# EAGLE design attiny24 (EAGLE 6.1)
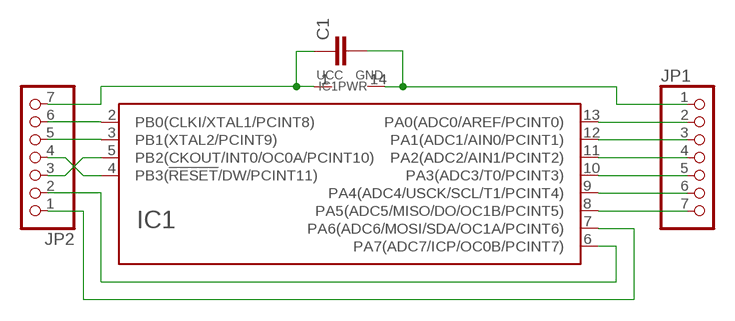
[diagram p0: schematic, sheet 1]

## Parts
C1  C-EUC0805K  [C0805K]
IC1  ATTINY24/44/84-SSU  [SOIC14]
JP1  PINHD-1X7  [1X07]
JP2  PINHD-1X7  [1X07]

## Nets
N$1: C1.1 IC1.1(UCC) JP2.7
N$2: C1.2 IC1.14(GND) JP1.1
N$3: IC1.4(PB3(!RESET!/DW/PCINT11)) JP2.4
N$4: IC1.2(PB0(CLKI/XTAL1/PCINT8)) JP2.6
N$5: IC1.3(PB1(XTAL2/PCINT9)) JP2.5
N$6: IC1.5(PB2(CKOUT/INT0/OC0A/PCINT10)) JP2.3
N$8: IC1.6(PA7(ADC7/ICP/OC0B/PCINT7)) JP2.2
N$9: IC1.7(PA6(ADC6/MOSI/SDA/OC1A/PCINT6)) JP2.1
N$10: IC1.13(PA0(ADC0/AREF/PCINT0)) JP1.2
N$11: IC1.12(PA1(ADC1/AIN0/PCINT1)) JP1.3
N$12: IC1.11(PA2(ADC2/AIN1/PCINT2)) JP1.4
N$13: IC1.10(PA3(ADC3/T0/PCINT3)) JP1.5
N$14: IC1.9(PA4(ADC4/USCK/SCL/T1/PCINT4)) JP1.6
N$15: IC1.8(PA5(ADC5/MISO/DO/OC1B/PCINT5)) JP1.7

## Library data of the parts
C1 = rcl:C-EU: CAPACITOR, European symbol
IC1 = atmel_tiny24-44-84tiny48-88mega48-88-168-328:ATTINY24/44/84
JP1 JP2 = pinhead:PINHD-1X7: PIN HEADER

## Board
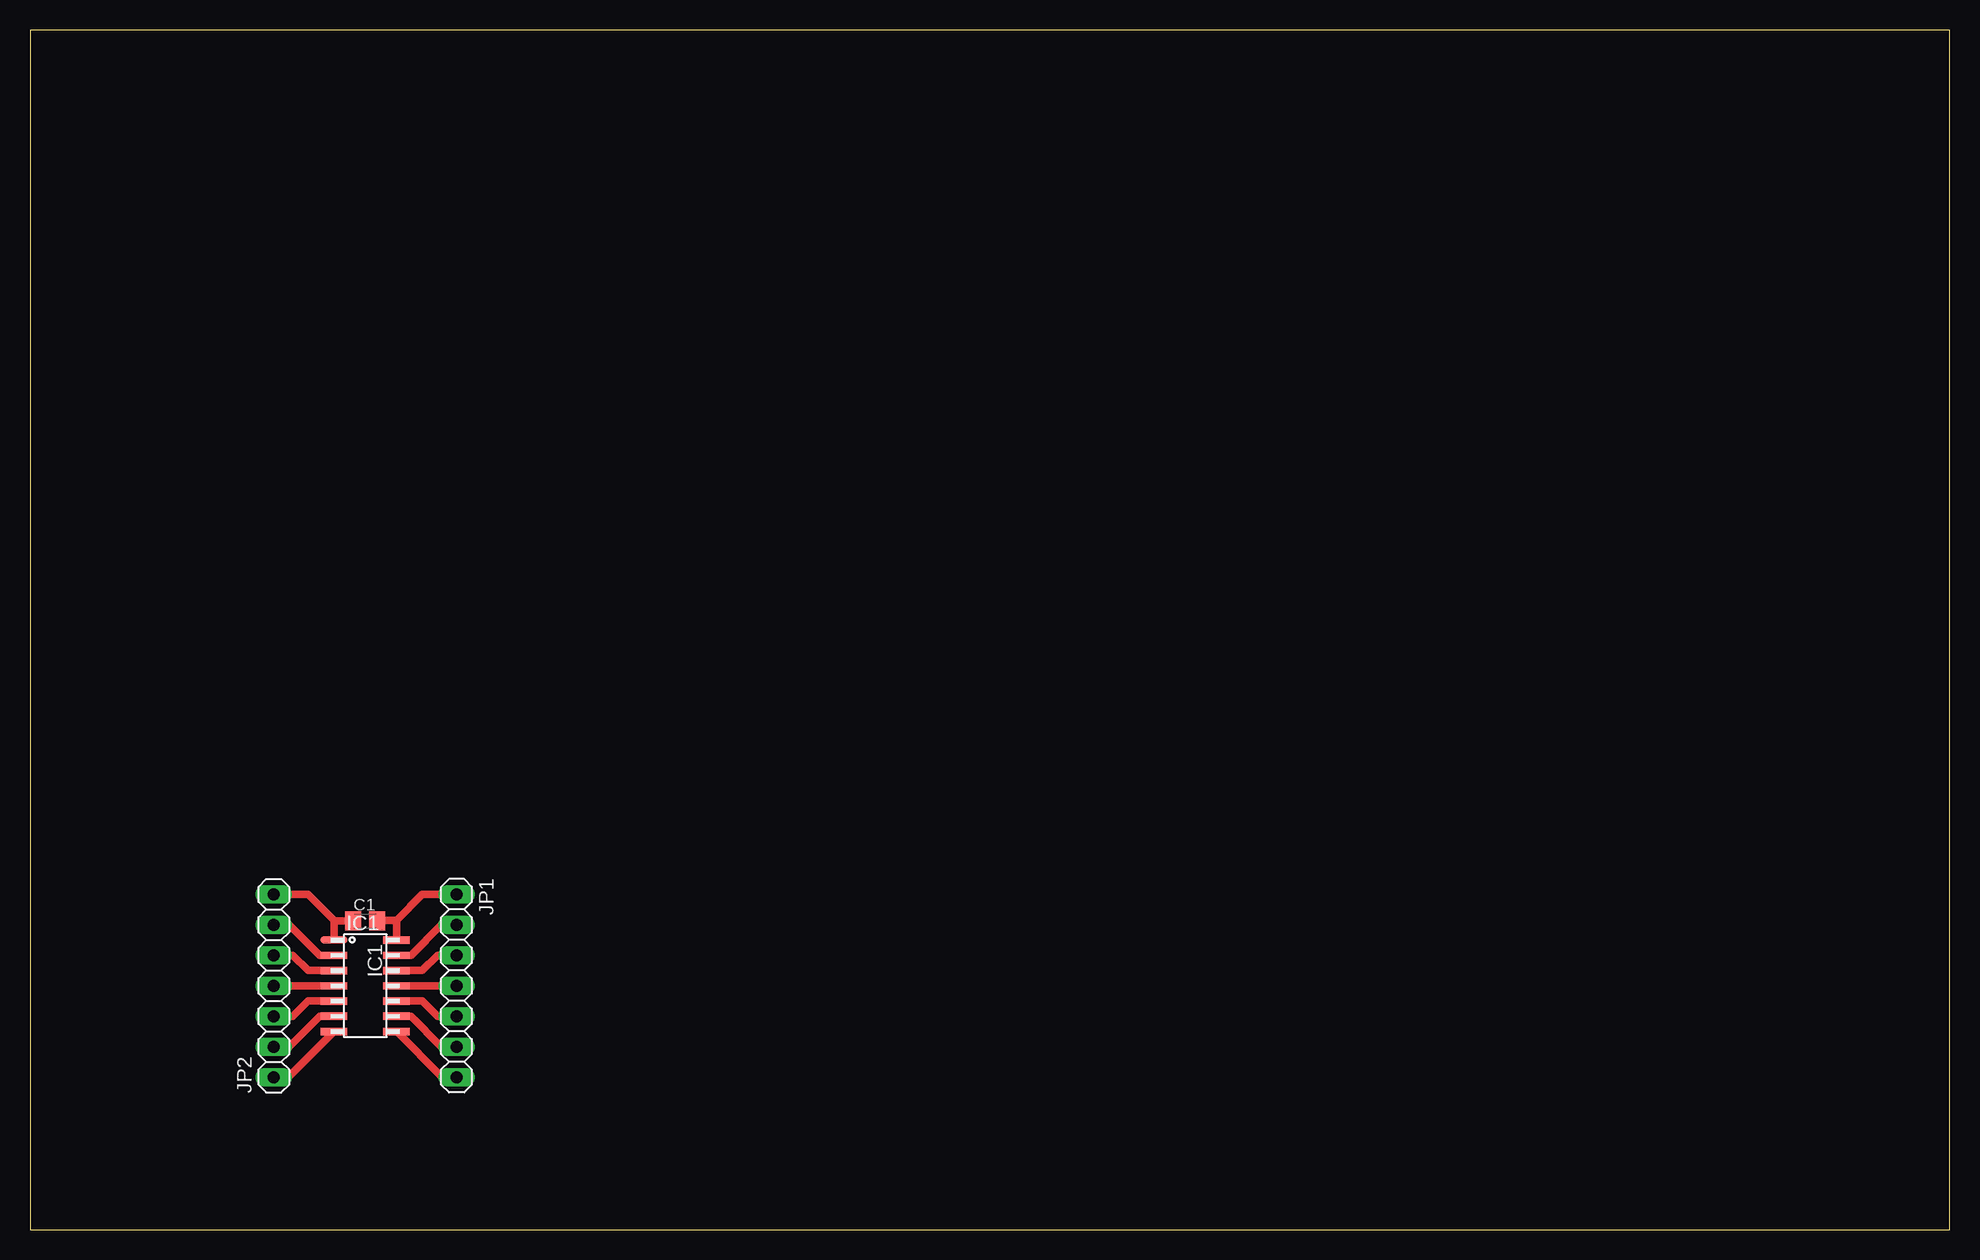
[diagram p1: board, top side]

Size 160 x 100 mm. Coordinates in mm from the lower left corner, seen from the top.
Outline: 0,0 160,0 160,100 0,100 0,0
Copper layers (1*16): Top 0.035mm / dielectric 1.5mm / Bottom 0.035mm
Design rules: minimum track width 10mil, minimum drill 24mil, track to track 8mil, track to pad 8mil, pad to pad 8mil, via to via 8mil, smd to smd 8mil, copper to edge 40mil, drill to drill 8mil, minimum pad ring 10mil, minimum via ring 8mil, stop-mask expansion 4mil, vias tented up to drill 0mil, thermal gap 10mil

### Footprints (pad centres in the part's own frame; a part is rotated, then mirrored left to right if it is on the bottom)
C0805K = smd 1.3 x 1.6: 1 -1,0; 2 1,0
SOIC14 = smd 0.61 x 2.21: 1 -3.81,-2.603; 2 -2.54,-2.603; 3 -1.27,-2.603; 4 0,-2.603; 5 1.27,-2.603; 6 2.54,-2.603; 7 3.81,-2.603; 8 3.81,2.603; 9 2.54,2.603; 10 1.27,2.603; 11 0,2.603; 12 -1.27,2.603; 13 -2.54,2.603; 14 -3.81,2.603
1X07 = drill 1.016 long: 1 -7.62,0; 2 -5.08,0; 3 -2.54,0; 4 0,0; 5 2.54,0; 6 5.08,0; 7 7.62,0

### Placement (x,y rotation side)
C1  27.94,25.72 0 top
IC1  27.94,20.32 270 top
JP1  35.56,20.32 270 top
JP2  20.32,20.32 90 top

### Tracks (layer width: path | path; a pad name or v marks a point on that pad's centre or on a via)
N$1
  Top 0.61: JP2.7 23.18,27.94 25.34,25.78 IC1.1 25.34,25.65 25.4,25.72 C1.1
N$2
  Top 0.61: IC1.14 30.54,25.78 | 30.54,25.78 32.7,27.94 JP1.1 | 30.54,25.78 29,25.78 C1.2
N$3
  Top 0.61: IC1.4 JP2.4
N$4
  Top 0.61: IC1.2 24.13,22.86 21.59,25.4 JP2.6
N$5
  Top 0.61: IC1.3 23.18,21.59 21.91,22.86 JP2.5
N$6
  Top 0.61: IC1.5 23.18,19.05 21.91,17.78 JP2.3
N$8
  Top 0.61: IC1.6 24.13,17.78 21.59,15.24 JP2.2
N$9
  Top 0.61: JP2.1 21.53,12.7 IC1.7
N$10
  Top 0.61: IC1.13 31.75,22.86 34.29,25.4 JP1.2
N$11
  Top 0.61: IC1.12 32.7,21.59 33.97,22.86 JP1.3
N$12
  Top 0.61: IC1.11 JP1.4
N$13
  Top 0.61: IC1.10 32.7,19.05 33.97,17.78 JP1.5
N$14
  Top 0.61: IC1.9 31.75,17.78 34.29,15.24 JP1.6
N$15
  Top 0.61: JP1.7 34.35,12.7 IC1.8